# Altium schematic sheet fan_interface.SchDoc
size A; SheetNumber: 11
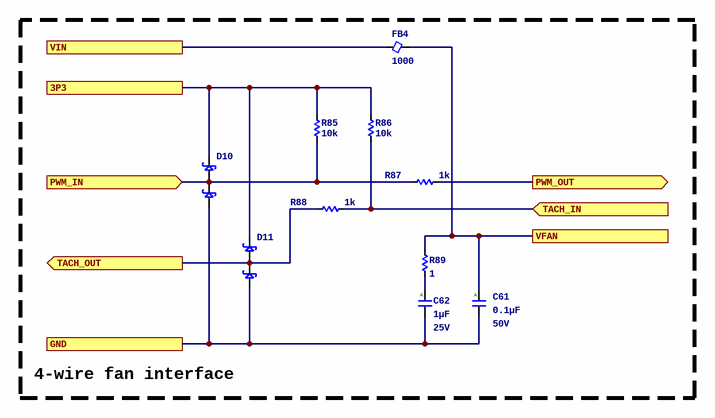
[diagram p0: fan_interface.SchDoc]

## Parts
C61  Capacitance: 0.1µF  Voltage - Rated: 50V  [C0402_0.55MM]  (hidden comment: CGA2B3X7R1H104M050BB)
C62  Capacitance: 1µF  Voltage - Rated: 25V  [C0603_0.80MM]  (hidden comment: CGJ3E1X7R1E105K080AC)
D10  BAT54SLT1G  [3SOT23]  (value not drawn)
D11  BAT54SLT1G  [3SOT23]  (value not drawn)
FB4  Impedance (Ohms @ 100MHz): 1000  [FB0805_1.05MM]  (hidden comment: MPZ2012S102AT000)
R85  Resistance: 10k  [R0402_0.40MM]
R86  Resistance: 10k  [R0402_0.40MM]
R87  Resistance: 1k  [R0402_0.40MM]
R88  Resistance: 1k  [R0402_0.40MM]
R89  Resistance: 1  [R0402_0.40MM]  (hidden comment: ERJ-2BQF1R0X)

## Blocks framed on the sheet
4-wire fan interface: C61 C62 D10 D11 FB4 R85-R89

## Ports
3P3, GND, PWM_IN (in), PWM_OUT (out), TACH_IN (in), TACH_OUT (out), VFAN, VIN

## Nets
3P3: D10.2 D11.2 R85.1 R86.1 ; port 3P3
GND: C61.2 C62.2 D10.1 D11.1 ; port GND
PWM_IN: D10.3 R85.2 R87.2 ; port PWM_IN
PWM_OUT: R87.1 ; port PWM_OUT
TACH_IN: R86.2 R88.1 ; port TACH_IN
TACH_OUT: D11.3 R88.2 ; port TACH_OUT
VFAN: C61.1 FB4.2 R89.2 ; port VFAN
VIN: FB4.1 ; port VIN
NetC62_1: C62.1 R89.1

## Notes on the sheet
- (in symbol CGA2B3X7R1H104M050BB) A
- (in symbol CGJ3E1X7R1E105K080AC) A

## Library data of the parts
C61 = CGA2B3X7R1H104M050BB: CAP CER 0.1UF 50V X7R 0402; Manufacturer: TDK Corporation; Unit Price (USD): 0.17; Tolerance: ±20%; ComponentLink1URL: https://product.tdk.com/info/en/catalog/datasheets/mlcc_automotive_general_en.pdf?ref_disty=digikey; ComponentLink1Description: Series Datasheet; Series: CGA; Part Status: Active; Temperature Coefficient: X7R; Operating Temperature: -55°C ~ 125°C; Applications: AEC-Q200; Mounting Type: Surface Mount, MLCC; Package / Case: 0402 (1005 Metric); Size / Dimension: 0.039" L x 0.020" W (1.00mm x 0.50mm); Thickness (Max): 0.022" (0.55mm); Supplier 1: Digikey; Supplier Part Number 1: 445-12271-1-ND; Manufacturer Part Number: CGA2B3X7R1H104M050BB
C62 = CGJ3E1X7R1E105K080AC: CAP CER 1UF 25V X7R 0603; Manufacturer: TDK Corporation; Unit Price (USD): 0.55; Tolerance: ±10%; ComponentLink1URL: https://product.tdk.com/info/en/catalog/datasheets/mlcc_highreliability_general_en.pdf?ref_disty=digikey; ComponentLink1Description: Series Datasheet; Series: CGJ; Part Status: Active; Temperature Coefficient: X7R; Operating Temperature: -55°C ~ 125°C; Applications: AEC-Q200; Mounting Type: Surface Mount, MLCC; Package / Case: 0603 (1608 Metric); Size / Dimension: 0.063" L x 0.031" W (1.60mm x 0.80mm); Thickness (Max): 0.031" (0.80mm); Supplier 1: Digikey; Supplier Part Number 1: 445-13311-1-ND; Manufacturer Part Number: CGJ3E1X7R1E105K080AC
D10 D11 = SCHOTTKY_30V_DUAL_BAT54SLT1G: DIODE SCHOTTKY DUAL 30V SOT23; Manufacturer: ON Semiconductor; Supplier 1: Digikey; Manufacturer Part Number: BAT54SLT1G; RoHS: RoHS Compliant; ComponentLink1URL: https://www.onsemi.com/pdf/datasheet/bat54slt1-d.pdf; ComponentLink1Description: Datasheet; Supplier Part Number 1: BAT54SLT1GOSCT-ND; Supplier 2: LCSC; Supplier Part Number 2: C19726
FB4 = MPZ2012S102AT000: FERRITE BEAD 1 KOHM 0805 1LN; Manufacturer: TDK Corporation; Filter Type: Power Line; Current Rating (Max): 1.5A; DC Resistance (DCR) (Max): 150mOhm; ComponentLink1URL: https://product.tdk.com/info/en/catalog/datasheets/beads_commercial_power_mpz2012_en.pdf?ref_disty=digikey; ComponentLink1Description: Datasheet; Series: MPZ; Part Status: Active; Operating Temperature: -55°C ~ 125°C; Package / Case: 0805 (2012 Metric); Mounting Type: Surface Mount; Height (Max): 0.041" (1.05mm); Size / Dimension: 0.079" L x 0.049" W (2.00mm x 1.25mm); Supplier Part Number 1: 445-5223-1-ND; Supplier 1: Digikey; Manufacturer Part Number: MPZ2012S102AT000
R85 R86 = ERJ-2RKF1002X: RES SMD 10K OHM 1% 1/10W 0402; Manufacturer 1: Panasonic Electronic Components; Unit Price (USD): 0.1; Power (Watts): 0.1W, 1/10W; Temperature Coefficient: ±100ppm/°C; ComponentLink1Description: Datasheet; ComponentLink1URL: https://industrial.panasonic.com/cdbs/www-data/pdf/RDA0000/AOA0000C304.pdf; Series: ERJ; Tolerance: ±1%; Composition: Thick Film; Features: Automotive AEC-Q200; Operating Temperature: -55°C ~ 155°C; Package / Case: 0402 (1005 Metric); Supplier Device Package: 0402; Size / Dimension: 0.039" L x 0.020" W (1.00mm x 0.50mm); Height - Seated (Max): 0.016" (0.40mm); Manufacturer Part Number 1: ERJ-2RKF1002X; Supplier 1: Digikey; Supplier Part Number 1: P10.0KLCT-ND
R87 R88 = ERJ-2RKF1001X: RES SMD 1K OHM 1% 1/10W 0402; Manufacturer 1: Panasonic Electronic Components; Unit Price (USD): 0.1; Power (Watts): 0.1W, 1/10W; Temperature Coefficient: ±100ppm/°C; ComponentLink1Description: Datasheet; ComponentLink1URL: https://industrial.panasonic.com/cdbs/www-data/pdf/RDA0000/AOA0000C304.pdf; Series: ERJ; Tolerance: ±1%; Composition: Thick Film; Features: Automotive AEC-Q200; Operating Temperature: -55°C ~ 155°C; Package / Case: 0402 (1005 Metric); Supplier Device Package: 0402; Size / Dimension: 0.039" L x 0.020" W (1.00mm x 0.50mm); Height - Seated (Max): 0.016" (0.40mm); Manufacturer Part Number 1: ERJ-2RKF1001X; Supplier 1: Digikey; Supplier Part Number 1: P1.00KLCT-ND
R89 = ERJ-2BQF1R0X: RES SMD 1 OHM 1% 1/6W 0402; Manufacturer: Panasonic Electronic Components; Unit Price (USD): 0.41; Power (Watts): 0.167W, 1/6W; Temperature Coefficient: ±250ppm/°C; ComponentLink1Description: Datasheet; ComponentLink1URL: https://industrial.panasonic.com/cdbs/www-data/pdf/RDN0000/AOA0000C313.pdf; Series: ERJ; Tolerance: ±1%; Composition: Thick Film; Features: Automotive AEC-Q200, Current Sense; Operating Temperature: -55°C ~ 125°C; Package / Case: 0402 (1005 Metric); Supplier Device Package: 0402; Size / Dimension: 0.039" L x 0.020" W (1.00mm x 0.50mm); Height - Seated (Max): 0.016" (0.40mm); Supplier 1: Digikey; Supplier Part Number 1: P17252CT-ND; Manufacturer Part Number: ERJ-2BQF1R0X